# EAGLE design Standalone Kaleidoscope 8085 POWER SUPPLY UNIT V1 (EAGLE 7.6.0)
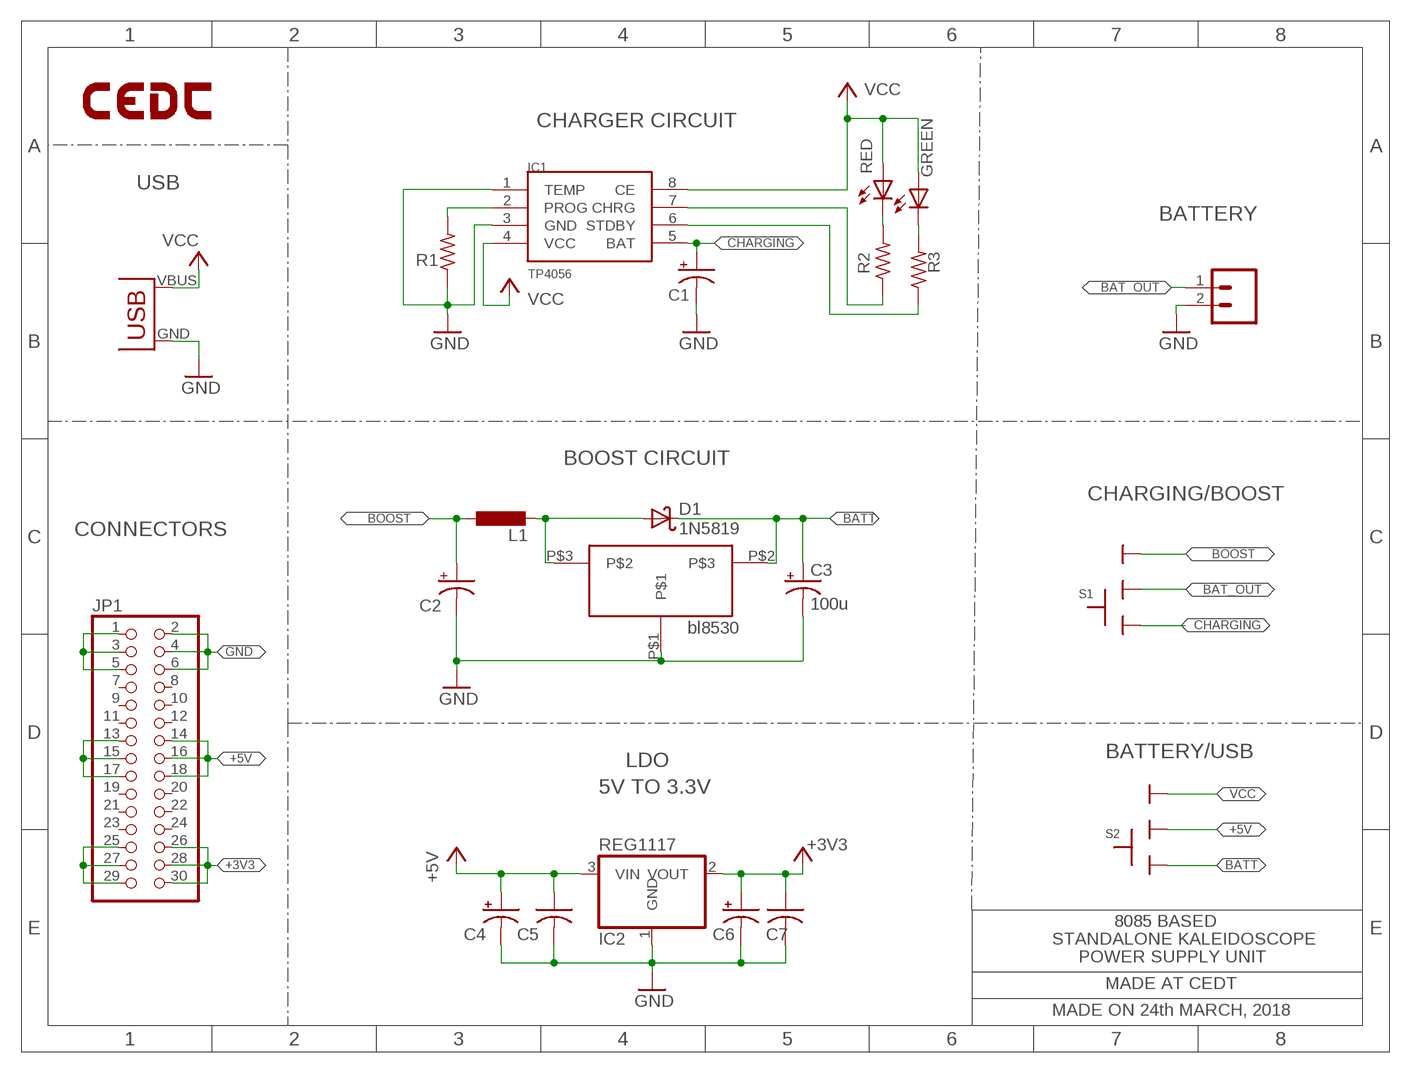
[diagram p0: schematic, sheet 1]

## Parts
BATTERY  M02  [02P]
BL8530  BL8530_5V  [BL8530_5V]
C1  10u  CAP_POL_10V  [C/6032-28R]
C2  10u  CAP_POL_10V  [C/6032-28R]
C3  100u  CAP_POL_10V  [C/6032-28R]
C4  10u  CAP_POL_10V  [C/6032-28R]
C5  0.1u  CAP0805  [C0805]
C6  10u  CAP_POL_10V  [C/6032-28R]
C7  0.1u  CAP0805  [C0805]
D1  1N5819  [DO41-10]
GREEN  LED3MM  [LED3MM]
IC1  TP4056  [SOP-8]
IC2  REG1117  [SOT223]
JP1  PINHD-2X15  [2X15]
L1  47uH  L-EUL4532P  [L4532P]
LOGO1  LOGO-CEDTBOT-18MM  [LOGO-CEDT-BOT-18MM]
R1  RESISTOR0805  [R0805]
R2  470  RESISTOR0805  [R0805]
R3  470  RESISTOR0805  [R0805]
RED  LED3MM  [LED3MM]
S1  SLIDESWITCH-BIG  [BIGSWITCH]
S2  SLIDESWITCH-BIG  [BIGSWITCH]
U$1  USB(POWER)  [USB(POWER)]

## Nets
+3V3: C6.+ C7.1 IC2.2(VOUT) JP1.25 JP1.26 JP1.27 JP1.28 JP1.29 JP1.30
+5V: C4.+ C5.1 IC2.3(VIN) JP1.13 JP1.14 JP1.15 JP1.16 JP1.17 JP1.18 S2.2
BAT_OUT: BATTERY.1 S1.2
BATT: BL8530.P$2 C3.+ D1.C S2.1
BOOST: C2.+ L1.1 S1.3
CHARGING: C1.+ IC1.5(BAT) S1.1
GND: BATTERY.2 BL8530.P$1 C1.- C2.- C3.- C4.- C5.2 C6.- C7.2 IC1.1(TEMP) IC1.3(GND) IC2.1(GND) JP1.1 JP1.2 JP1.3 JP1.4 JP1.5 JP1.6 R1.1 U$1.GND
N$1: IC1.2(PROG) R1.2
N$4: R2.2 RED.K(C)
N$5: IC1.6(STDBY) R3.1
N$7: IC1.7(CHRG) R2.1
N$8: BL8530.P$3 D1.A L1.2
N$15: GREEN.K(C) R3.2
VCC: GREEN.A IC1.4(VCC) IC1.8(CE) RED.A S2.3 U$1.VBUS(VCC)
Unconnected: JP1.7 JP1.8 JP1.9 JP1.10 JP1.11 JP1.12 JP1.19 JP1.20 JP1.21 JP1.22 JP1.23 JP1.24

## Notes on the sheet
- CHARGER CIRCUIT
- USB
- BOOST CIRCUIT
- CHARGING/BOOST
- CONNECTORS
- bl8530
- BATTERY/USB
- LDO
- 5V TO 3.3V
- 8085 BASED
- STANDALONE KALEIDOSCOPE
- POWER SUPPLY UNIT
- MADE AT CEDT
- MADE ON 24th MARCH, 2018

## Library data of the parts
BATTERY = CEDT_JANUARY_2015_v5:M02: AMP QUICK CONNECTOR
BL8530 = PSU_TT_SMD:BL8530_5V
C1 C2 C4 C6 = CEDT_JANUARY_2015_v5:CAP_POL
C3 = CEDT_JANUARY_2015_v7:CAP_POL
C5 C7 = CEDT_JANUARY_2015_v5:CAP
D1 = CEDT_JANUARY_2015_v5:1N5819: DIODE general purpose rectifier, 1 A
GREEN RED = Arduino_Hackathon_v5:LED
IC1 = TP4056:TP4056
IC2 = CEDT_JANUARY_2015_v5:REG1117: 800mA and 1A Low Dropout (LDO) Positive Regulator 1.8V, 2.5V, 2.85V, 3.3V, 5V, and Adj
JP1 = pinhead:PINHD-2X15: PIN HEADER
L1 = rcl:L-EU: INDUCTOR, European symbol
LOGO1 = CEDT_JANUARY_2015_v5:LOGO-CEDT
R1-R3 = CEDT_JANUARY_2015_v5:RESISTOR
S1 S2 = CEDT_JANUARY_2015_v5:SLIDESWITCH
U$1 = CEDT_JANUARY_2015_v7:USB(POWER)

## Board
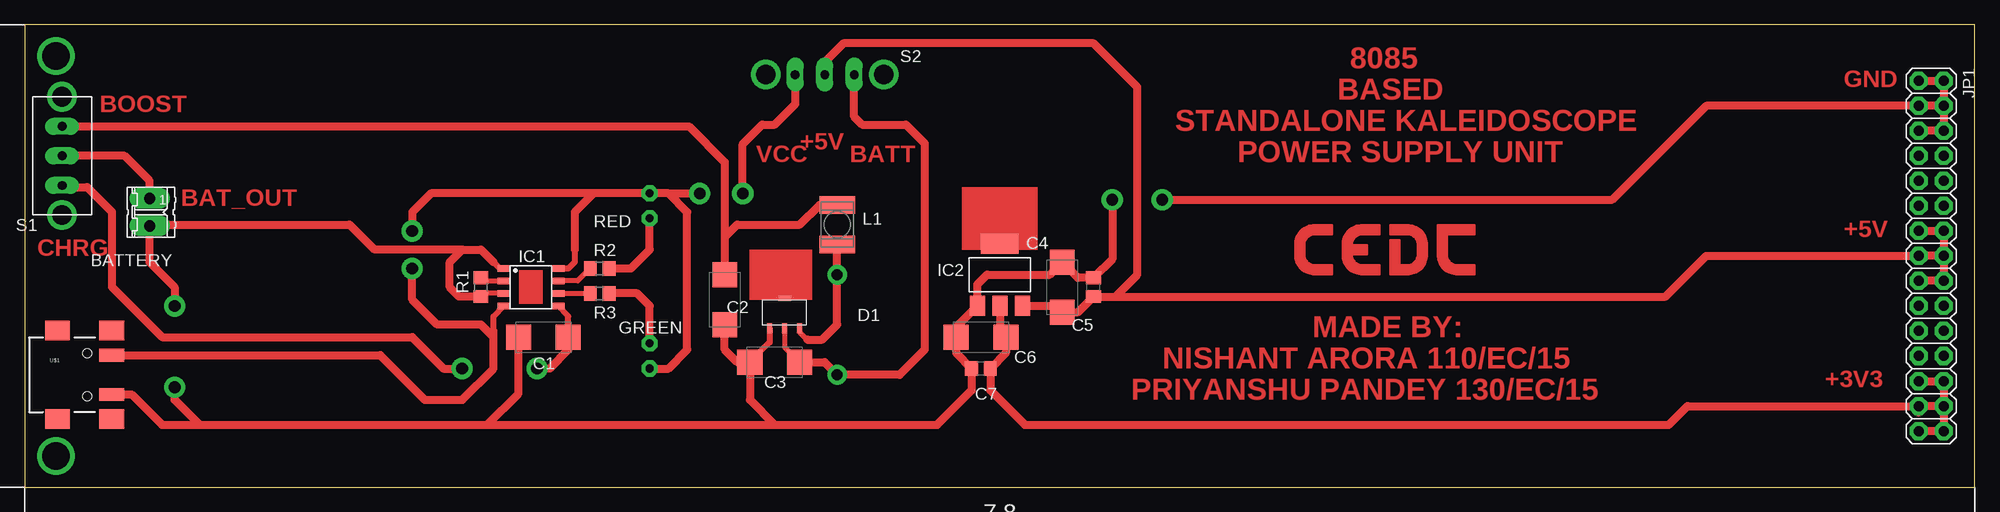
[diagram p1: board, top side]
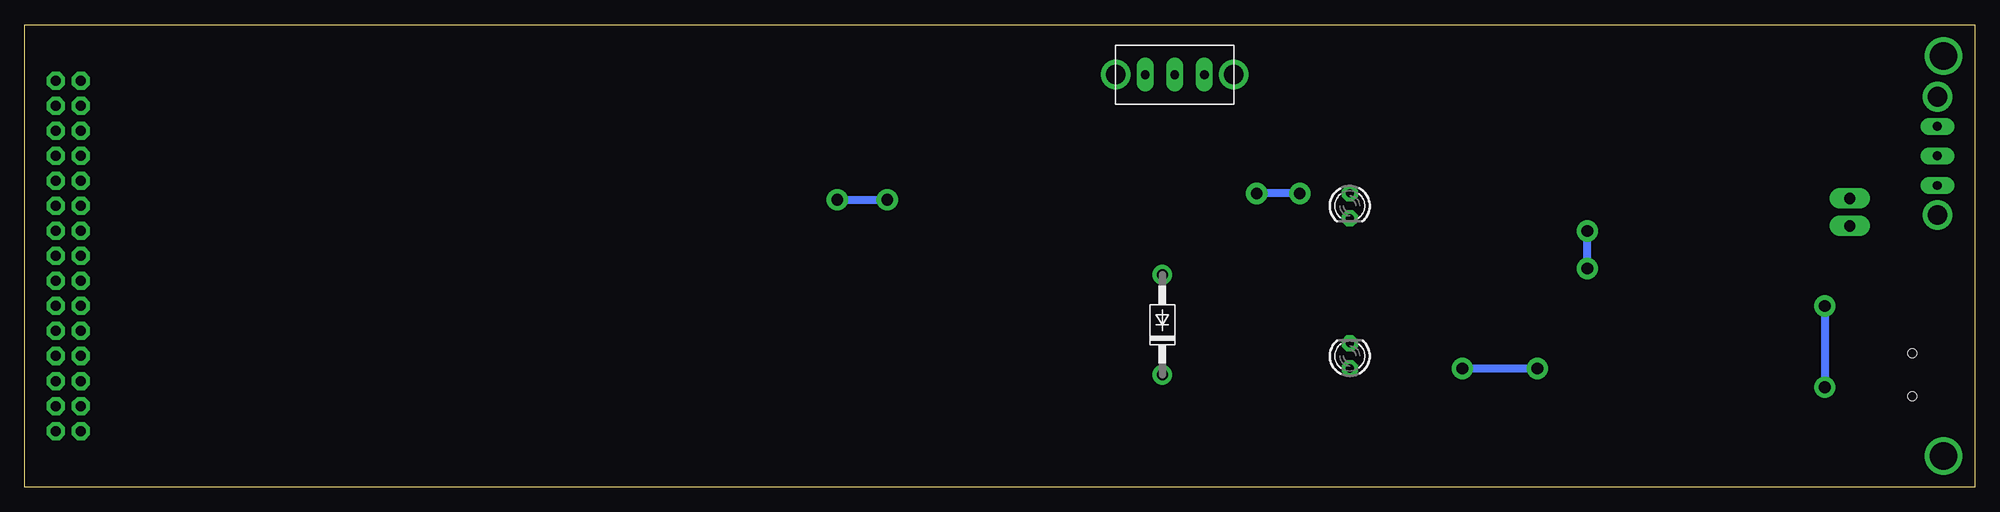
[diagram p2: board, bottom side, seen from below]

Size 198.12 x 46.99 mm. Coordinates in mm from the lower left corner, seen from the top.
Outline: 0,0 198.12,0 198.12,46.99 0,46.99 0,0
Copper layers (1*16): Top 0.035mm / dielectric 1.5mm / Bottom 0.035mm
Design rules "default *": minimum track width 12mil, minimum drill 0.35mm, track to track 14mil, track to pad 14mil, pad to pad 14mil, via to via 14mil, smd to smd 14mil, copper to edge 40mil, drill to drill 6mil, minimum pad ring 16mil, minimum via ring 16mil, stop-mask expansion 4mil, vias tented up to drill 0mil, thermal gap 10mil

### Footprints (pad centres in the part's own frame; a part is rotated, then mirrored left to right if it is on the bottom)
02P = drill 1.143 long: 1 -1.397,0; 2 1.397,0
BL8530_5V = smd 0.508 x 1.016: P$1 0.762,-0.381; P$2 2.286,-0.381; P$3 3.81,-0.381 | smd 1.27 x 0.508: P$4 2.286,2.667
C/6032-28R = smd 2.55 x 2.5: + 2.525,0; - -2.525,0
C0805 = smd 1.3 x 1.5: 1 -0.95,0; 2 0.95,0
DO41-10 = drill 1.118: A 5.08,0; C -5.08,0
LED3MM = drill 0.813 octagon: A -1.27,0; K 1.27,0
SOP-8 = smd 1.3 x 0.7: 1 -2.75,1.905; 2 -2.75,0.635; 3 -2.75,-0.635; 4 -2.75,-1.905; 5 2.75,-1.905; 6 2.75,-0.635; 7 2.75,0.635; 8 2.75,1.905
SOT223 = smd 1.499 x 2.007: 1 -2.261,-3.15; 2 0.025,-3.15; 3 2.311,-3.15 | smd 3.81 x 2.007: 4 0,3.15
2X15 = drill 1.016 octagon: 1 -17.78,-1.27; 2 -17.78,1.27; 3 -15.24,-1.27; 4 -15.24,1.27; 5 -12.7,-1.27; 6 -12.7,1.27; 7 -10.16,-1.27; 8 -10.16,1.27; 9 -7.62,-1.27; 10 -7.62,1.27; 11 -5.08,-1.27; 12 -5.08,1.27; 13 -2.54,-1.27; 14 -2.54,1.27; 15 0,-1.27; 16 0,1.27; 17 2.54,-1.27; 18 2.54,1.27; 19 5.08,-1.27; 20 5.08,1.27; 21 7.62,-1.27; 22 7.62,1.27; 23 10.16,-1.27; 24 10.16,1.27; 25 12.7,-1.27; 26 12.7,1.27; 27 15.24,-1.27; 28 15.24,1.27; 29 17.78,-1.27; 30 17.78,1.27
L4532P = smd 1.8 x 3.6: 1 -2,0; 2 2,0
R0805 = smd 1.3 x 1.5: 1 -0.95,0; 2 0.95,0
BIGSWITCH = drill 0.9 long: 1 -3,0; 2 0,0; 3 3,0 | drill 2 pad 2.184: TAB1 -6,0; TAB2 6,0
USB(POWER) = smd 2.54 x 1.27: GND 2.5,-1.981; VBUS 2.5,1.981 | smd 2.5 x 2: GND@1 -3,-4.5; GND@2 -3,4.5; GND@3 2.5,4.5; GND@4 2.5,-4.5 | hole 0.9: 0,2.2; 0,-2.2

### Placement (x,y rotation side)
BATTERY  12.7,27.94 270 top
BL8530  74.93,16.51 0 top
C1  52.7,15.24 0 top
C2  71.12,19.05 90 top
C3  76.2,12.7 0 top
C4  105.41,20.32 270 top
C5  108.58,20.32 90 top
C6  97.16,15.24 0 top
C7  97.16,12.06 180 top
D1  82.55,16.51 90 bottom
GREEN  63.5,13.34 90 bottom
IC1  51.44,20.32 0 top
IC2  99.06,21.59 0 top
JP1  193.68,23.5 270 top
L1  82.55,26.67 270 top
LOGO1  147.32,21.59 0 bottom
R1  46.35,20.32 90 top
R2  58.42,22.23 0 top
R3  58.42,19.68 0 top
RED  63.5,28.57 270 bottom
S1  3.81,33.66 90 top
S2  81.28,41.91 0 bottom
U$1  6.35,11.43 0 top

### Tracks (layer width: path | path; a pad name or v marks a point on that pad's centre or on a via)
+3V3
  Top 0.813: IC2.2 99.08,15.84 C6.+ 99.68,13.64 C7.1 98.11,9.85 101.6,6.35 167,6.35 168.91,8.26 JP1.27 193.04,8.26 | JP1.25 JP1.26 JP1.28 | JP1.28 193.04,8.26 | JP1.28 JP1.30 JP1.29 | 192.41,7.62 193.04,8.26
+5V
  Top 0.813: IC2.3 104.77,18.44 C4.+ 107.01,17.8 C5.1 110.81,19.37 | 110.81,19.37 113.03,21.59 113.03,40.64 108.58,45.09 83.19,45.09 81.28,43.18 S2.2 | JP1.13 JP1.14 JP1.16 | JP1.16 JP1.15 170.81,23.5 166.69,19.37 110.81,19.37 | JP1.16 JP1.18 JP1.17
BAT_OUT
  Top 0.813: BATTERY.1 12.7,31.11 10.16,33.66 S1.2
BATT
  Top 0.508: BL8530.P$2 77.22,14.21 C3.+
  Top 0.813: C3.+ 81.28,12.7 D1.C 88.9,11.43 91.44,13.97 91.44,34.92 89.53,36.83 85.09,36.83 84.28,37.64 S2.1
BOOST
  Top 0.813: 71.12,25.4 71.12,33.02 67.48,36.66 S1.3 | 71.12,25.4 C2.+ | 71.12,25.4 72.39,26.67 78.74,26.67 80.74,28.67 L1.1
CHARGING  (via drill 1.19 pad 1.93)
  Top 0.61: C1.+ 55.23,17.37 IC1.5
  Top 0.813: v44.45,12.06 42.55,12.06 39.37,15.24 13.97,15.24 8.89,20.32 8.89,24.13 8.89,27.94 6.35,30.48 3.98,30.48 S1.1 | C1.+ 55.23,13.96 53.34,12.06 v52.07,12.06
  Bottom 0.813: v44.45,12.06 v52.07,12.06
GND  (via drill 1.19 pad 1.93)
  Top 0.508: R1.1 46.67,19.68 IC1.3
  Top 0.61: BL8530.P$1 75.69,14.72 C3.- | IC1.1 48.26,22.23 47.62,22.86
  Top 0.813: C1.- 50.16,15.22 50.16,9.53 46.99,6.35 | v110.49,29.21 110.49,23.18 C5.2 106.98,21.27 C4.- 104.16,21.59 97.79,21.59 96.8,20.6 IC2.1 94.63,16.27 C6.- 94.63,13.64 C7.2 96.2,9.85 92.71,6.35 76.2,6.35 | R1.1 44.13,19.37 43.18,20.32 43.18,22.86 44.45,24.13 | 47.62,22.86 46.35,24.13 44.45,24.13 | 44.45,24.13 35.56,24.13 33.02,26.67 12.83,26.67 BATTERY.2 12.7,22.86 15.24,20.32 v15.24,18.41 | C2.- 71.12,13.97 72.39,12.7 C3.- 73.67,8.88 76.2,6.35 | 8.93,9.53 U$1.GND 10.87,9.45 13.97,6.35 17.78,6.35 | 17.78,6.35 15.24,8.89 v15.24,10.16 | 17.78,6.35 46.99,6.35 | 46.99,6.35 76.2,6.35 | JP1.1 JP1.2 JP1.4 | JP1.4 JP1.3 170.81,38.73 161.29,29.21 v115.57,29.21 | JP1.4 JP1.6 JP1.5
  Bottom 0.813: v115.57,29.21 v110.49,29.21 | v15.24,18.41 v15.24,10.16
N$1
  Top 0.508: R1.2 46.67,20.95 IC1.2
N$2  (via drill 2.79 pad 1.93)
  other vias: 3.17,43.81
N$3  (via drill 2.79 pad 1.93)
  other vias: 3.17,3.17
N$4
  Top 0.813: R2.2 61.59,22.23 63.5,24.13 RED.K
N$5
  Top 0.508: IC1.6 R3.1
N$7
  Top 0.508: R2.1 56.2,20.95 IC1.7
N$8
  Top 0.508: BL8530.P$3 78.74,15.75 79.5,14.99
  Top 0.813: 79.5,14.99 81.03,14.99 82.55,16.51 D1.A L1.2
N$15
  Top 0.813: GREEN.K 63.5,18.41 62.23,19.68 R3.2
VCC  (via drill 1.19 pad 1.93)
  Top 0.61: IC1.8 55.24,22.23 55.88,22.86 55.88,24.13 | 47.62,15.88 47.62,17.36 IC1.4
  Top 0.813: GREEN.A 65.41,12.06 67.31,13.97 67.31,27.94 65.41,29.84 | 65.41,29.84 RED.A 57.78,29.84 | 57.78,29.84 55.88,27.94 55.88,24.13 | 8.93,13.34 U$1.VBUS 36.12,13.41 40.64,8.89 44.45,8.89 47.62,12.06 47.62,15.24 | 47.62,15.24 47.62,15.88 | 47.62,15.24 46.35,16.51 41.91,16.51 39.37,19.05 v39.37,22.23 | 57.78,29.84 41.27,29.84 39.37,27.94 v39.37,26.04 | 65.41,29.84 v68.58,29.84 | v72.96,29.84 72.96,34.86 74.93,36.83 76.2,36.83 78.28,38.91 S2.3
  Bottom 0.813: v39.37,22.23 v39.37,26.04 | v68.58,29.84 v72.96,29.84
(copper drawn outside any net)
  shapes: Top area x4

### Text on the board
Top: 8085 | GND | BASED | BOOST | STANDALONE KALEIDOSCOPE | +5V | VCC | BATT | POWER SUPPLY UNIT | BAT_OUT | +5V | CHRG | MADE BY: | NISHANT ARORA 110/EC/15 | +3V3 | PRIYANSHU PANDEY 130/EC/15